# Altium schematic sheet FET__Converter.SchDoc: RP2040 CNC
size B; Author: AM; CompanyName: Expatria Technologies; DrawnBy: A.Marles; Engineer: AM; Organization: Expatria Technolgoies; DocumentNumber: 4; SheetNumber: 7; SheetTotal: 7
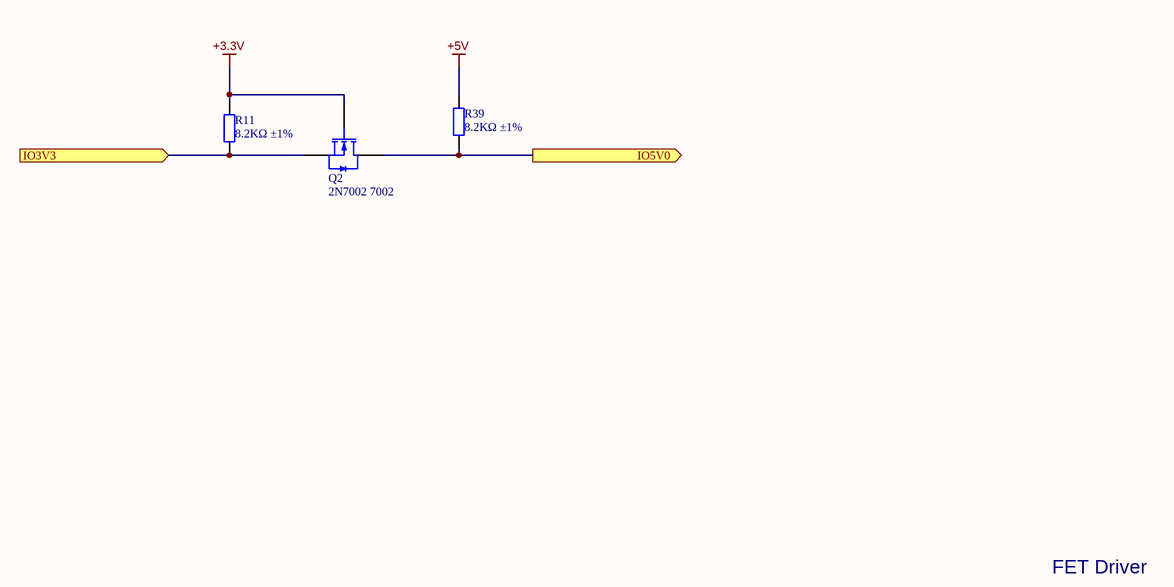
[diagram p0: FET__Converter.SchDoc]

## Parts
Q2  2N7002 7002  [SOT-23(SOT-23-3)]
R11  8.2KΩ ±1%  [0402_R]
R39  8.2KΩ ±1%  [0402_R]

## Ports
IO3V3 (in), IO5V0 (out)

## Nets
+3.3V: Q2.1(G) R11.2
+5V: R39.2
IO3V3: Q2.2(S) R11.1 ; port IO3V3
IO5V0: Q2.3(D) R39.1 ; port IO5V0

## Notes on the sheet
- FET Driver
- SHEET
- Expatria Technologies
- 1136 Glade Court
- Port Coquitlam, BC V3B 1R5
- PROJECT
- SIZE
- ENGR
- MODIFIED
- DOCUMENT
- REV
- Copyright Expatria Technologies 2023. This document describes Open Hardware and is licensed under the CERN-OHL-S v2. No warranty is implied or expressed.
- EMAIL: INFO@EXPATRIA.CA
- B
- /

## Library data of the parts
Q2 = 2N7002 7002: MOS(场效应管); ComponentLink1Description: 供应商链接; ComponentLink1URL: http://www.szlcsc.com/product/details_9040.html; Package: SOT-23(SOT-23-3); Supplier: LC; SuppliersPartNumber: C8545
R11 R39 = 0402 8.2K (8201) 1%: Chip resistor; Manufacturer: Uniroyal Elec; PartNumber: 0402WGF8201TCE; Power: 1/16W; ComponentLink1Description: Supplier link; ComponentLink1URL: http://www.szlcsc.com/product/details_26667.html; Package: 0402; Supplier: LC; SuppliersPartNumber: C25924; Resistance: 8.2KΩ; Tolerance: 1%